# EAGLE design S0-energy-meter-switch-v1.1 (EAGLE 9.6.2)
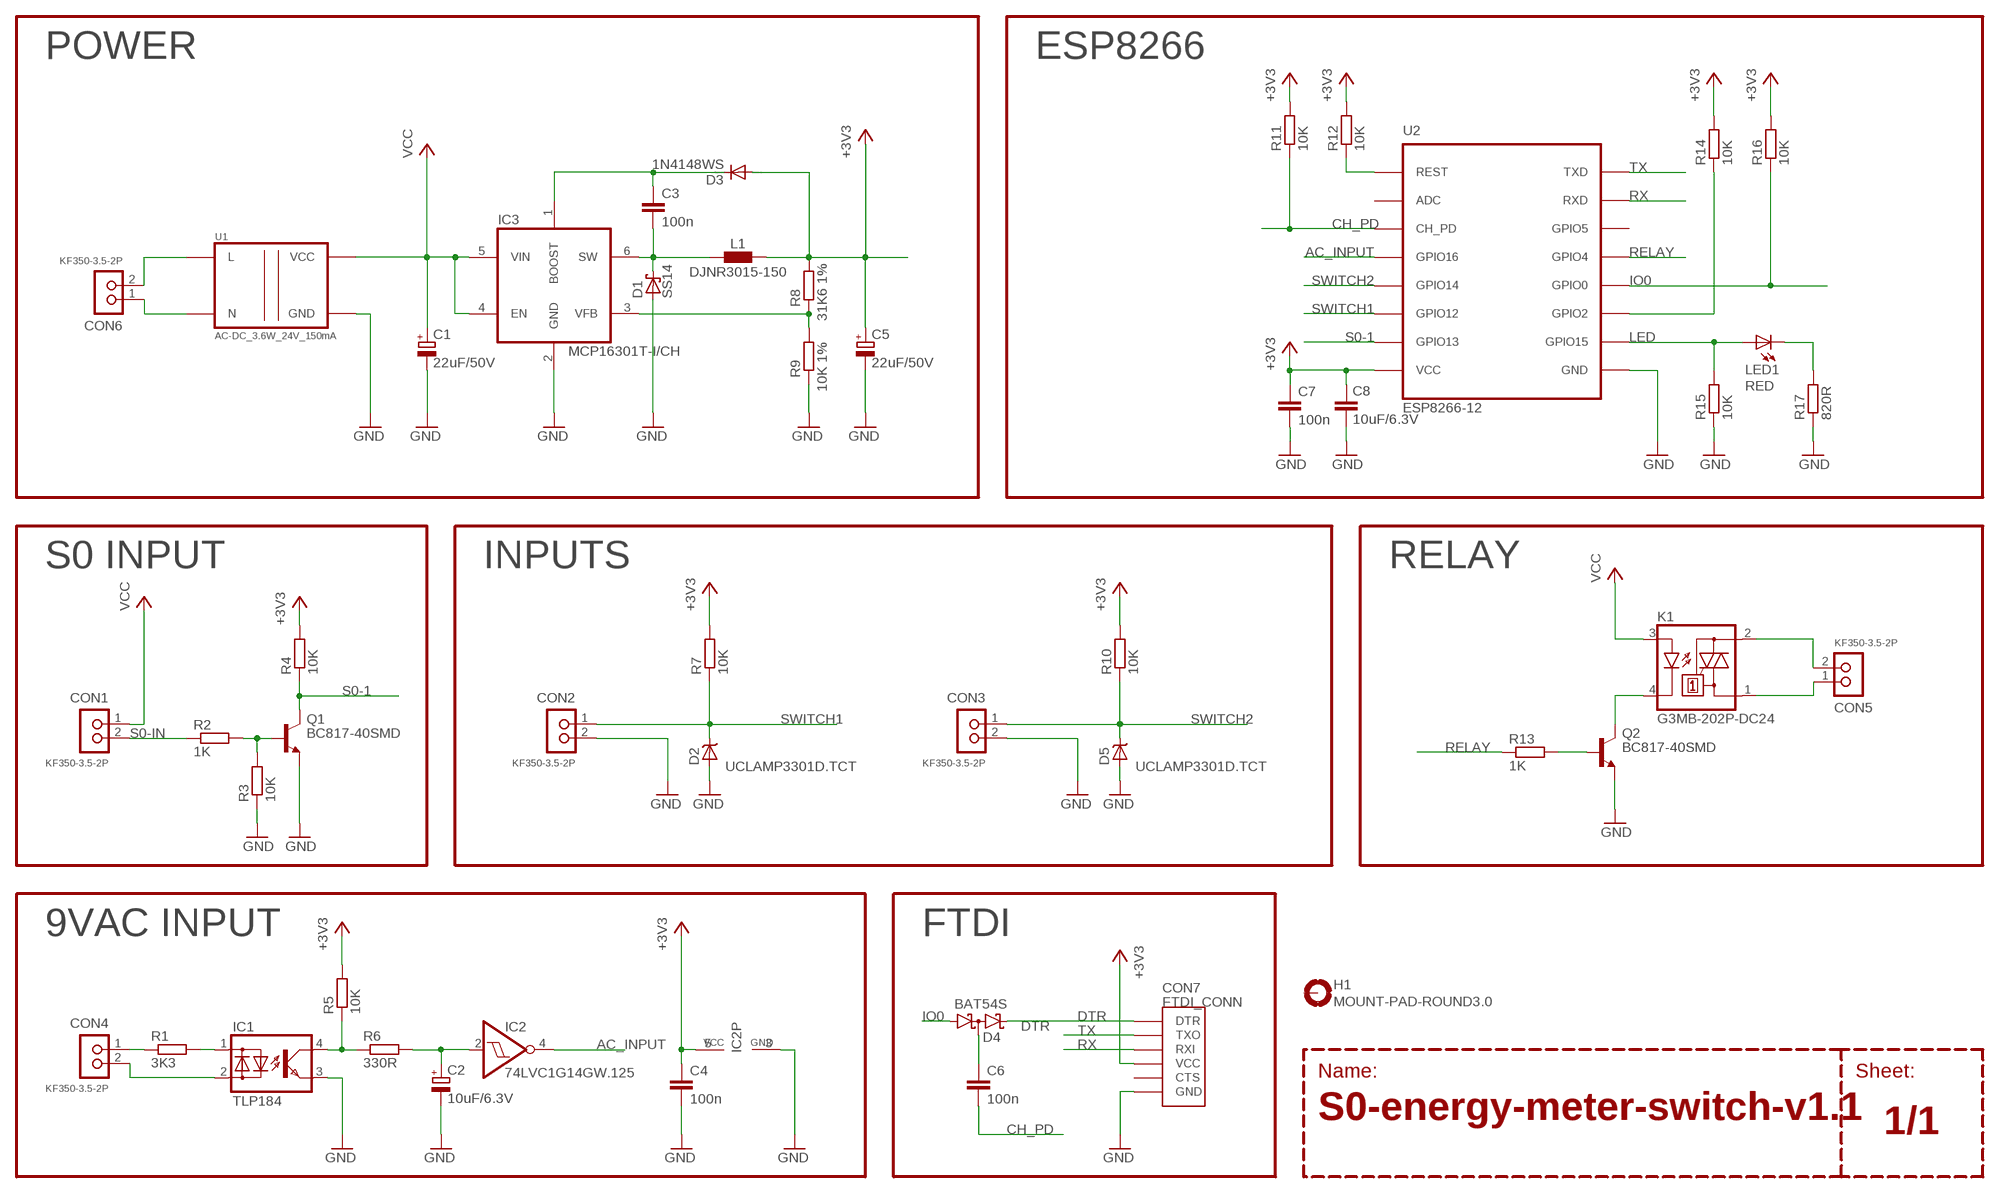
[diagram p0: schematic, sheet 1]

## Parts
C1  22uF/50V  CPOL-EUC  [PANASONIC_C]
C2  10uF/6.3V  CPOL-EUCT3528  [CT3528]
C3  100n  C-EUC0805  [C0805]
C4  100n  C-EUC0805  [C0805]
C5  22uF/50V  CPOL-EUC  [PANASONIC_C]
C6  100n  C-EUC0805  [C0805]
C7  100n  C-EUC0805  [C0805]
C8  10uF/6.3V  C-EUC0805  [C0805]
CON1  KF350-3.5-2P  [KF350-3.50-2P]
CON2  KF350-3.5-2P  [KF350-3.50-2P]
CON3  KF350-3.5-2P  [KF350-3.50-2P]
CON4  KF350-3.5-2P  [KF350-3.50-2P]
CON5  KF350-3.5-2P  [KF350-3.50-2P]
CON6  KF350-3.5-2P  [KF350-3.50-2P]
CON7  FTDI_CONN  [FTDI]
D1  SS14  [DO214AC]
D2  UCLAMP3301D.TCT  [SOD323]
D3  1N4148WS  [SOD323]
D4  BAT54S  [SOT23]
D5  UCLAMP3301D.TCT  [SOD323]
H1  MOUNT-PAD-ROUND3.0  [3,0-PAD]
IC1  TLP184  [SOP04]
IC2  74LVC1G14GW.125  74LVC1G14DCK  [SC70-5]
IC3  MCP16301T-I/CH  [SOT23-6]
K1  G3MB-202P-DC24  [G3MB]
L1  DJNR3015-150  [L3015]
LED1  RED  LED0805  [LED0805]
Q1  BC817-40SMD  [SOT23-BEC]
Q2  BC817-40SMD  [SOT23-BEC]
R1  3K3  R-EU_R1206  [R1206]
R2  1K  R-EU_R0805  [R0805]
R3  10K  R-EU_R0805  [R0805]
R4  10K  R-EU_R0805  [R0805]
R5  10K  R-EU_R0805  [R0805]
R6  330R  R-EU_R0805  [R0805]
R7  10K  R-EU_R0805  [R0805]
R8  31K6 1%  R-EU_R0805  [R0805]
R9  10K 1%  R-EU_R0805  [R0805]
R10  10K  R-EU_R0805  [R0805]
R11  10K  R-EU_R0805  [R0805]
R12  10K  R-EU_R0805  [R0805]
R13  1K  R-EU_R0805  [R0805]
R14  10K  R-EU_R0805  [R0805]
R15  10K  R-EU_R0805  [R0805]
R16  10K  R-EU_R0805  [R0805]
R17  820R  R-EU_R0805  [R0805]
U1  AC-DC_3.6W_24V_150mA  AC-DC_3.6W  [AC_DC_24V_150MA]
U2  ESP8266-12  [ESP-12]

## Nets
4: IC1.1(A) R1.2
+3V3: C4.1 C5.+ C7.1 C8.1 CON7.P$4(VCC) D3.A IC2.5(VCC) L1.1 R4.2 R5.2 R7.2 R8.2 R10.2 R11.2 R12.2 R14.2 R16.2 U2.VCC
AC_INPUT: IC2.4(O) U2.GPIO16
CH: C6.1 D4.3(C1A2)
CH_PD: C6.2 R11.1 U2.CH_PD
DTR: CON7.P$1(DTR) D4.2(C2)
GND: C1.- C2.- C4.2 C5.- C7.2 C8.2 CON2.2 CON3.2 CON7.P$6(GND) D1.A D2.A D5.A IC1.3(EMIT) IC2.3(GND) IC3.2(GND) Q1.E Q2.E R3.1 R9.1 R15.1 R17.1 U1.GND U2.GND
IO0: D4.1(A1) R16.1 U2.GPIO0
L: CON6.2 U1.L
LED: LED1.A R15.2 U2.GPIO15
N: CON6.1 U1.N
N$1: LED1.C R17.2
N$2: CON5.1 K1.1(A1)
N$3: Q1.B R2.2 R3.2
N$4: C2.+ IC2.2(I) R6.2
N$5: CON5.2 K1.2(A2)
N$6: CON4.2 IC1.2(C)
N$7: IC1.4(COL) R5.1 R6.1
N$8: K1.4(C) Q2.C
N$9: Q2.B R13.2
N$10: R12.1 U2.REST
N$12: CON4.1 R1.1
N$13: R14.1 U2.GPIO2
N$16: C3.2 D1.C IC3.6(SW) L1.2
N$17: C3.1 D3.C IC3.1(BOOST)
N$18: IC3.3(VFB) R8.1 R9.2
RELAY: R13.1 U2.GPIO4
RX: CON7.P$3(RXI) U2.RXD
S0-1: Q1.C R4.1 U2.GPIO13
S0-IN: CON1.2 R2.1
SWITCH1: CON2.1 D2.C R7.1 U2.GPIO12
SWITCH2: CON3.1 D5.C R10.1 U2.GPIO14
TX: CON7.P$2(TXO) U2.TXD
VCC: C1.+ CON1.1 IC3.4(EN) IC3.5(VIN) K1.3(A) U1.VCC
Unconnected: CON7.P$5(CTS) H1.B3,0(MOUNT) U2.ADC U2.GPIO5

## Notes on the sheet
- POWER | ESP8266
- S0 INPUT | INPUTS | RELAY
- 9VAC INPUT | FTDI
- Name: | Sheet:

## Library data of the parts
C1 C2 C5 = rcl:CPOL-EU: POLARIZED CAPACITOR, European symbol; SPICEPREFIX: C
C3 C4 C7 C8 = rcl:C-EU: CAPACITOR, European symbol; SPICEPREFIX: C
C6 = rcl:C-EU: CAPACITOR, European symbol
CON1-CON6 = my-con-terminal:KF350-3.5-2P: Screw terminal 3.5mm pitch
CON7 = my-connectors:FTDI_CONN: Connector which mates to FTDI basic or FTDI cable.
D1 = my-diode:SS?*: Schottky Barrier Rectifier; A: 1; V: 40
D2 D5 = my-diode:UCLAMP3301?.TCT: Low Voltage μClamp TVS diode
D3 = my-diode:1N4148: Fast Switching Diode
D4 = diode:BAT54S: Schottky Diodes Pin connection corrected 2011-05-04 Source: Fairchild .. BAT54.pdf
H1 = holes:MOUNT-PAD-ROUND: MOUNTING PAD, round
IC1 = my-opto:TLP184: AC Photocoupler
IC2 = 74xx-little-de:74*1G14: Single Schmitt-Trigger Inverter Gate
IC3 = my-power:MCP16301*T-I/?: High-Voltage Step-Down Regulator 4.0V to 30V / 4.7V to 36V (H)
K1 = my-relay:G3MB-202P?-DC*: SSR Relay Zero Cross 2A, 100-240 VAC
L1 = my-inductor:DJNR?-*: SMD Power Coil; UH: 15
LED1 = my-opto:LED
Q1 Q2 = transistor-npn:BC817*: NPN Transistor
R1-R17 = rcl:R-EU_: RESISTOR, European symbol; SPICEPREFIX: R
U1 = my-modules:AC-DC_?: AC-DC regulator; TYPE: 3.6W AC 110V/220V To DC 24V 150mA
U2 = my-ESP8266:ESP8266

## Board
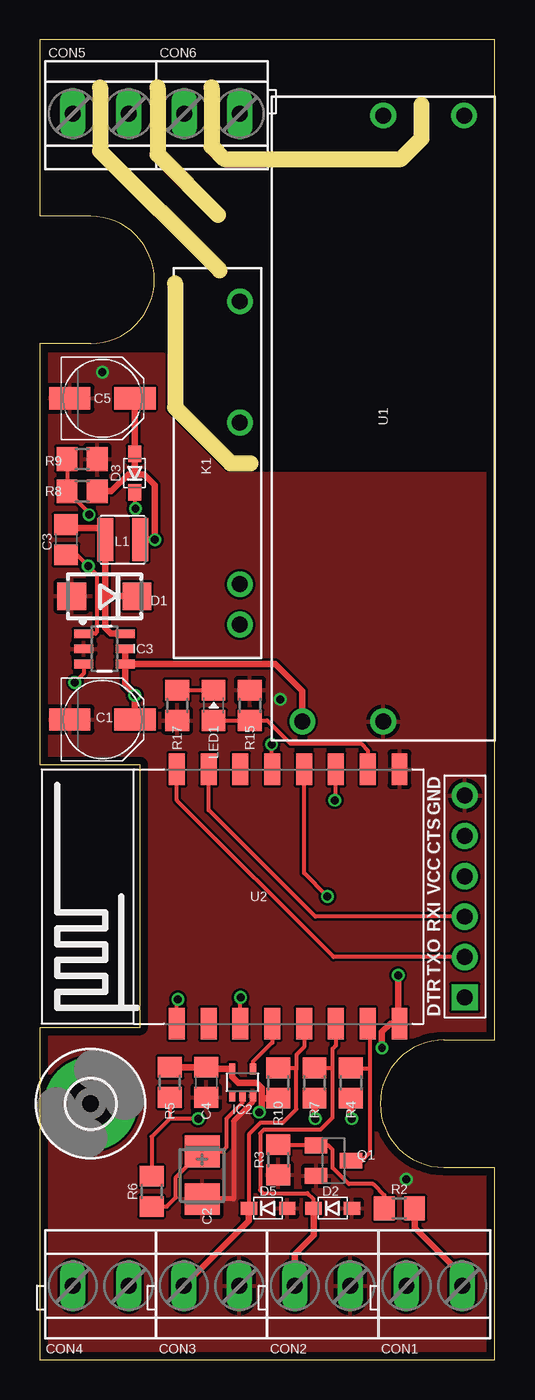
[diagram p1: board, top side]
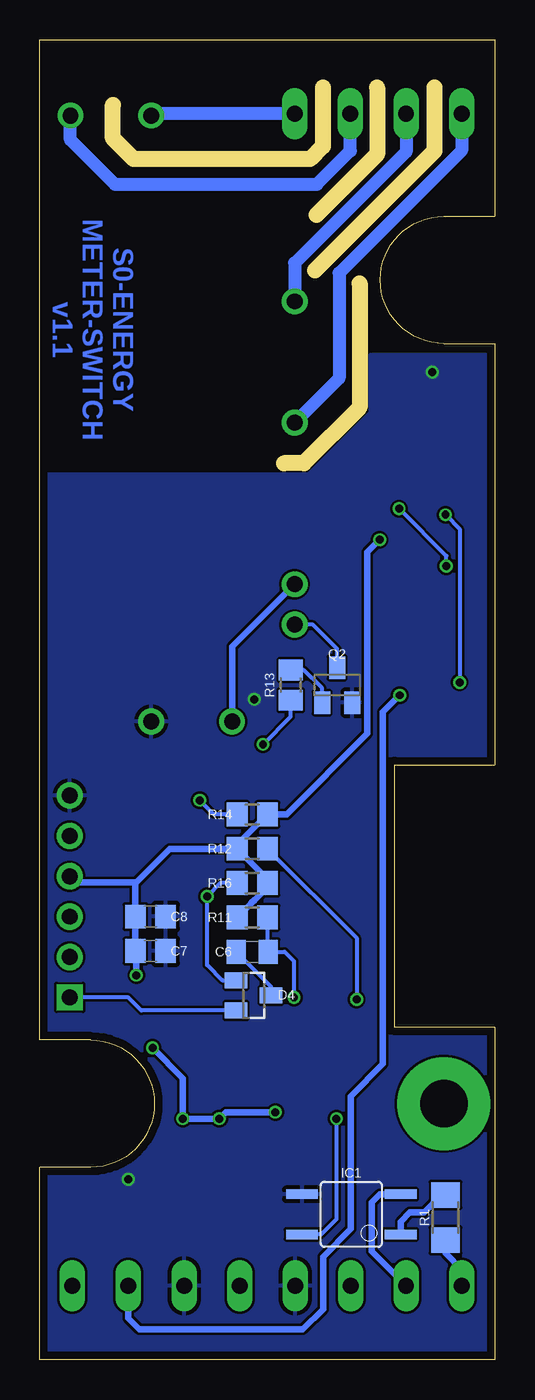
[diagram p2: board, bottom side, seen from below]

Size 28.6 x 83 mm. Coordinates in mm from the lower left corner, seen from the top.
Outline: 28.6,0 28.6,12.1 25.4,12.1 arc-180 25.4,20.1 28.6,20.1 28.6,83 0,83 0,71.9 3.2,71.9 arc-180 3.2,63.9 0,63.9 0,37.4 6.3,37.4 6.3,20.9 0,20.9 0,0 28.6,0
Copper layers (1*16): Top 0.035mm / dielectric 1.6mm / Bottom 0.035mm
Design rules "Elecrow_2-layer_optimal_PCB_eagle_rule": minimum track width 6mil, minimum drill 12mil, track to track 6mil, track to pad 6mil, pad to pad 6mil, via to via 8mil, smd to smd 0mil, copper to edge 20mil, drill to drill 10mil, minimum pad ring 12mil, minimum via ring 6mil, stop-mask expansion 0mil, vias tented up to drill 100mil, thermal gap 10mil
Milling: 12 lines

### Footprints (pad centres in the part's own frame; a part is rotated, then mirrored left to right if it is on the bottom)
PANASONIC_C = smd 2.6 x 1.4: + 2.05,0; - -2.05,0
CT3528 = smd 2 x 2.2: + -1.5,0; - 1.5,0
C0805 = smd 1.3 x 1.5: 1 -0.95,0; 2 0.95,0
C0805' = smd 1.2 x 1.5: 1 -1,0; 2 1,0
KF350-3.50-2P = drill 1 long: 1 -1.75,0; 2 1.75,0
FTDI = drill 1 pad 1.651 square: P$1 -6.35,0 | drill 1 pad 1.651: P$2 -3.81,0; P$3 -1.27,0; P$4 1.27,0; P$5 3.81,0; P$6 6.35,0
DO214AC = smd 1.8 x 1.7: A 2.05,0; C -2.05,0
SOD323 = smd 1.03 x 0.839: A 1.206,0; C -1.206,0
SOT23 = smd 1 x 1.4: 1 -0.95,-1.1; 2 0.95,-1.1; 3 0,1.1
3,0-PAD = drill 3 pad 5.842: B3,0 0,0
SOP04 = smd 0.6 x 2: 1 -1.27,-3.1; 2 1.27,-3.1; 3 1.27,3.1; 4 -1.27,3.1
SC70-5 = smd 0.4 x 0.7: 1 -0.65,-0.85; 2 0,-0.85; 3 0.65,-0.85; 4 0.65,0.85; 5 -0.65,0.85
SOT23-6 = smd 1.2 x 0.55: 1 -1.3,0.95; 2 -1.3,0; 3 -1.3,-0.95; 4 1.3,-0.95; 5 1.3,0; 6 1.3,0.95
G3MB = drill 1: 1 10.16,-1.4; 2 2.54,-1.4; 3 -7.62,-1.4; 4 -10.16,-1.4
L3015 = smd 1 x 2.7: 1 -1.1,0; 2 1.1,0
LED0805 = smd 1.5 x 1.3: A 0,-0.95; C 0,0.95
SOT23-BEC = smd 1 x 1.4: B -0.95,-1.1; C 0,1.1; E 0.95,-1.1
R1206 = smd 1.6 x 1.803: 1 -1.422,0; 2 1.422,0
R0805 = smd 1.3 x 1.5: 1 -0.95,0; 2 0.95,0
AC_DC_24V_150MA = drill 1: GND -19.05,0; L 19.05,-5.08; N 19.05,0; VCC -19.05,5.08
ESP-12 = smd 1 x 2: ADC -1.5,-8; CH_PD 0.5,-8; GND 10.5,8; GPIO0 4.5,8; GPIO2 6.5,8; GPIO4 2.5,8; GPIO5 0.5,8; GPIO12 6.5,-8; GPIO13 8.5,-8; GPIO14 4.5,-8; GPIO15 8.5,8; GPIO16 2.5,-8; REST -3.5,-8; RXD -1.5,8; TXD -3.5,8; VCC 10.5,-8

### Placement (x,y rotation side)
C1  3.94,40.26 0 top
C2  10.21,11.61 270 top
C3  1.65,51.56 90 top
C4  10.46,17.45 270 top
C5  3.94,60.45 0 top
C6  100n  [C0805']  15.24,25.65 0 bottom
C7  21.64,25.7 0 bottom
C8  21.64,27.86 0 bottom
CON1  24.8,4.65 0 top
CON2  17.77,4.65 0 top
CON3  10.8,4.65 0 top
CON4  3.83,4.65 0 top
CON5  3.83,78.35 180 top
CON6  10.83,78.35 180 top
CON7  26.72,29.13 90 top
D1  4.06,48.01 180 top
D2  18.41,9.53 0 top
D3  5.97,55.75 90 top
D4  15.16,22.91 270 bottom
D5  14.35,9.53 0 top
H1  3.2,16.1 0 top
IC1  9.02,9.14 90 bottom
IC2  12.75,17.45 0 top
IC3  4.06,44.7 0 top
K1  11.18,56.39 90 top
L1  5.21,51.56 180 top
LED1  10.92,41.15 0 top
Q1  18.46,12.53 270 top
Q2  9.91,42.42 0 bottom
R1  3.1,8.94 90 bottom
R2  22.61,9.53 180 top
R3  14.99,12.57 90 top
R4  19.56,17.4 270 top
R5  8.18,17.45 90 top
R6  7.03,10.59 270 top
R7  17.27,17.4 270 top
R8  2.67,54.61 0 top
R9  2.67,56.64 180 top
R10  14.99,17.4 270 top
R11  15.24,27.81 180 bottom
R12  15.24,32.13 180 bottom
R13  12.83,42.42 90 bottom
R14  15.24,34.29 0 bottom
R15  13.21,41.15 270 top
R16  15.24,29.97 0 bottom
R17  8.64,41.15 90 top
U1  21.59,59.18 90 top
U2  12.11,29.13 0 top

### Tracks (layer width: path | path; a pad name or v marks a point on that pad's centre or on a via)
4
  Bottom 0.406: R1.2 3.35,10.36 4.44,9.27 5.33,9.27 5.92,8.69 IC1.1
+3V3  (via drill 0.5)
  Top 0.406: R4.2 19.56,15.21 v19.61,15.16 | R5.2 C4.1 10.56,18.3 IC2.5 12.1,17.79 12.49,17.4 13.65,17.4 13.95,17.09 13.95,16.45 | v22.53,24.18 22.53,21.22 U2.VCC 22.02,21.13 21.51,20.62 v21.51,19.61 | R8.2 4.51,54.61 5.57,55.67 5.97,55.67 | 5.97,55.67 D3.A 5.97,60.43 C5.+ | R7.2 17.27,15.21 v17.32,15.16 | L1.1 v7.24,51.56 7.24,54.99 6.56,55.67 5.97,55.67 | 13.95,16.45 13.95,15.73 v13.79,15.57 | 13.95,16.45 R10.2
  Bottom 0.406: v22.53,24.18 22.53,25.64 C7.1 C8.1 22.59,29.96 22.53,30.02 | R12.2 20.42,32.13 22.53,30.02 | 22.53,30.02 26.34,30.02 CON7.P$4 | v21.51,19.61 19.61,17.7 v19.61,15.16 v17.32,15.16 16.91,15.57 v13.79,15.57 | R12.2 16.19,32.39 15.4,33.18 15.39,33.18 15.18,33.39 15.18,33.4 R14.2 13.08,34.29 8,39.37 8,50.8 v7.24,51.56 | R11.2 15.3,28.71 15.09,28.92 15.08,28.92 14.29,29.71 R16.2 14.29,30.23 15.08,31.02 15.09,31.02 15.3,31.23 15.3,31.24 R12.2
AC_INPUT
  Top 0.254: U2.GPIO16 14.61,19.95 13.4,18.73 IC2.4
CH
  Bottom 0.254: D4.3 14.06,23.46 16.24,25.64 C6.1
CH_PD  (via drill 0.5)
  Top 0.254: U2.CH_PD v12.61,22.77 v12.62,22.78
  Bottom 0.254: v12.62,22.78 12.62,25.07 13.21,25.65 C6.2 14.29,25.7 R11.1
DTR
  Bottom 0.254: D4.2 22.21,21.96 23.04,22.78 CON7.P$1
GND  (via drill 0.5)
  Top 0.305: IC2.3 13.4,16.22 12.19,15.01 12.19,10.11 C2.-
  other vias: 23.04,11.35 3.94,62.1 15.11,41.53
  pour Top: 0,20.9 0,0 28.6,0 28.6,12.1 25.4,12.1 arc-180 25.4,20.1 28.6,20.1 28.6,55.7 11.7,55.7 7.8,59.6 7.8,63.2 0,63.2 0,37.4 6.3,37.4 6.3,20.9
  pour Bottom: 0,20.9 0,0 28.6,0 28.6,12.1 25.4,12.1 arc-180 25.4,20.1 28.6,20.1 28.6,55.7 11.7,55.7 7.8,59.6 7.8,63.2 0,63.2 0,37.4 6.3,37.4 6.3,20.9
IO0  (via drill 0.5)
  Top 0.254: v18.08,29.13 16.61,30.6 U2.GPIO0
  Bottom 0.254: R16.1 17.24,29.97 v18.08,29.13 18.08,24.81 17.13,23.86 D4.1
L
  Bottom 0.813: U1.L 26.67,76.71 23.88,73.91 11.18,73.91 9.08,76.02 CON6.2
LED
  Top 0.254: LED1.A R15.2 14.29,40.2 15.75,38.73 20.19,38.73 20.61,38.31 U2.GPIO15
N
  Bottom 0.813: CON6.1 21.47,78.35 U1.N
N$1
  Top 0.254: R17.2 LED1.C
N$2
  Bottom 0.813: CON5.1 5.58,75.95 12.58,68.96 K1.1
N$3
  Top 0.254: R2.2 21.66,10.35 20.95,11.05 19.43,11.05 18.41,12.06 18.41,13.21 18.15,13.47 Q1.B 17.32,13.52 R3.2
N$4
  Top 0.254: R6.2 7.99,9.64 8.56,10.21 8.56,11.48 10.18,13.11 C2.+ 11.48,13.11 11.73,13.36 11.73,15.16 12.75,16.18 IC2.2
N$5
  Bottom 0.813: CON5.2 2.08,76.03 9.78,68.33 9.78,61.72 K1.2
N$6
  Bottom 0.406: CON4.2 7.75,6.82 7.75,9.91 7.24,10.41 IC1.2
N$7  (via drill 0.5)
  Top 0.254: R5.1 8.18,15.16 | R6.1 7.03,14.02 8.18,15.16 | v9.95,15.16 8.18,15.16
  Bottom 0.254: v9.95,15.16 9.95,8.84 10.92,7.87 IC1.4
N$8
  Bottom 0.254: Q2.C 9.91,44.7 11.43,46.23 K1.4
N$9
  Bottom 0.254: Q2.B 10.86,42.23 12,43.37 R13.2
N$10  (via drill 0.5)
  Top 0.254: U2.REST 8.61,22.58 v8.68,22.65
  Bottom 0.254: R12.1 8.68,26.52 v8.68,22.65
N$12
  Bottom 0.406: R1.1 3.1,6.68 2.08,5.67 CON4.1
N$13  (via drill 0.5)
  Top 0.254: v18.54,35.18 18.61,35.25 U2.GPIO2
  Bottom 0.254: R14.1 17.65,34.29 v18.54,35.18
N$16
  Top 0.406: C3.2 1.86,52.31 4.11,52.31 L1.2 4.11,48.01 | 4.11,48.01 D1.C | IC3.6 4.47,45.65 4.11,46.02 4.11,48.01
N$17  (via drill 0.5)
  Top 0.254: C3.1 2.35,50.61 v3.05,49.91 3.6,49.35 3.6,45.77 3.49,45.65 IC3.1 | D3.C 5.97,53.56 v6.02,53.52
  Bottom 0.254: v6.02,53.52 3.05,50.55 v3.05,49.91
N$18  (via drill 0.5)
  Top 0.254: R9.2 R8.1 3.1,53.23 v3.1,53.13 | IC3.3 2.76,43.15 v2.21,42.59
  Bottom 0.254: v3.1,53.13 2.21,52.24 v2.21,42.59
RELAY  (via drill 0.5)
  Top 0.254: U2.GPIO4 14.57,37.18 v14.57,38.7
  Bottom 0.254: R13.1 12.83,40.44 v14.57,38.7
RX
  Top 0.254: CON7.P$3 17.32,27.86 10.61,34.57 U2.RXD
S0-1
  Top 0.254: U2.GPIO13 20.75,21 20.75,18.29 | 19.67,18.46 R4.1 19.62,18.29 20.75,18.29 | Q1.C 20.27,12.53 20.75,13 20.75,18.29
S0-IN
  Top 0.406: CON1.2 26.55,5.3 23.56,8.29 R2.1
SWITCH1
  Top 0.254: U2.GPIO12 18.61,19.76 18.41,19.56 18.41,18.29 | 18.41,18.29 18.41,15.24 17.65,14.48 14.1,14.48 13.84,14.22 13.84,10.67 14.03,10.48 16.83,10.48 17.21,10.1 D2.C | R7.1 18.35,18.35 18.41,18.29
  Top 0.406: CON2.1 16.02,6.62 17.21,7.81 D2.C
SWITCH2
  Top 0.254: U2.GPIO14 16.61,19.66 16.13,19.18 16.13,18.35 16.13,18.29 | 16.13,18.29 16.13,15.75 15.27,14.89 13.87,14.89 13.14,14.16 D5.C | R10.1 16.07,18.35 16.13,18.29
  Top 0.406: CON3.1 13.14,8.74 D5.C
TX
  Top 0.254: CON7.P$2 18.46,25.32 8.61,35.17 U2.TXD
VCC  (via drill 0.5)
  Top 0.406: IC3.4 IC3.5 | U1.VCC 16.51,42.04 14.79,43.75 IC3.4 | C1.+ 5.97,40.28 v5.97,41.78 5.36,42.39 IC3.4
  Bottom 0.406: v5.97,41.78 7.03,40.72 7.03,18.59 9.05,16.57 9.05,8.22 10.79,6.48 10.79,3.17 12.06,1.91 22.35,1.91 23.05,2.6 CON1.1 | U1.VCC 16.51,44.83 K1.3

### Text on the board
Bottom: S0-ENERGY / METER-SWITCH / v1.1